# Altium schematic sheet ControllerV2.1_2.SchDoc
size A; SheetNumber: 2; SheetTotal: 2
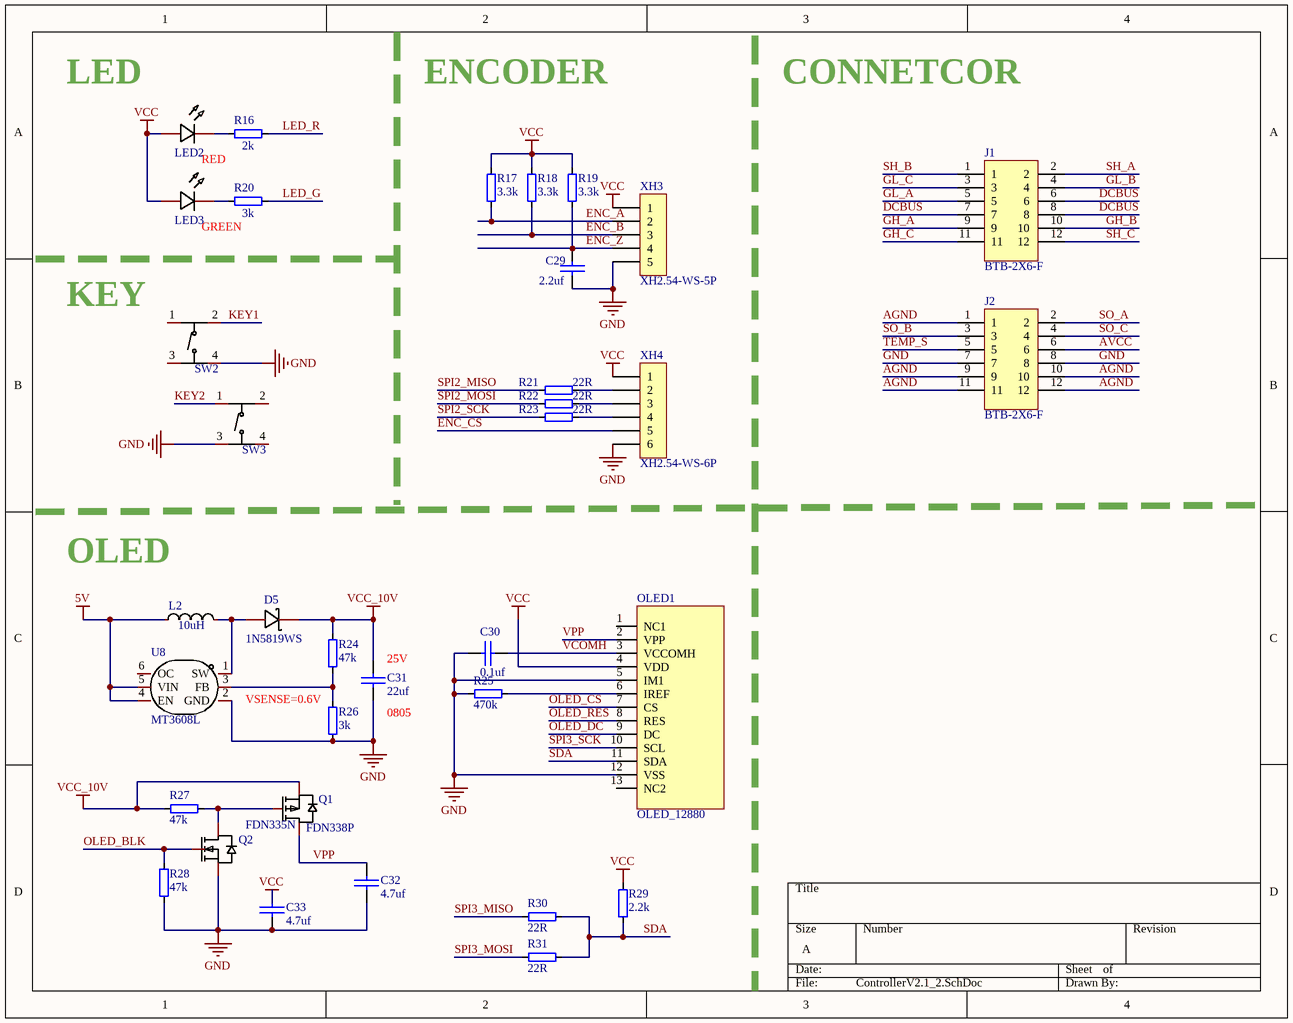
[diagram p0: ControllerV2.1_2.SchDoc]

## Parts
C29  2.2uf  [0603C]
C30  0.1uf  [0603C]
C31  22uf  [0805C]
C32  4.7uf  [0603C]
C33  4.7uf  [0603C]
D5  1N5819WS  [SOD-323]
J1  BTB-2X6-F  [BTB-F-0.8mm-2x6P]
J2  BTB-2X6-F  [BTB-F-0.8mm-2x6P]
L2  10uH  [IND-SMD_L3.0-W3.0_SWPA3010S]
LED2  LED_0603-B  [LED_0603]  (value not drawn)
LED3  LED_0603-B  [LED_0603]  (value not drawn)
OLED1  OLED_12880  [OLED_12880]
Q1  FDN338P  [SOT-23-3]
Q2  FDN335N  [SOT-23-3]
R16  2k  [0603R]
R17  3.3k  [0603R]
R18  3.3k  [0603R]
R19  3.3k  [0603R]
R20  3k  [0603R]
R21  22R  [0603R]
R22  22R  [0603R]
R23  22R  [0603R]
R24  47k  [0603R]
R25  470k  [0603R]
R26  3k  [0603R]
R27  47k  [0603R]
R28  47k  [0603R]
R29  2.2k  [0603R]
R30  22R  [0603R]
R31  22R  [0603R]
SW2  TS-1187A-B-A-B  [TSW SMD-4*4*1.5]  (value not drawn)
SW3  TS-1187A-B-A-B  [TSW SMD-4*4*1.5]  (value not drawn)
U8  MT3608L  [SOT-23-6]
XH3  XH2.54-WS-5P  [XH2.54-WS-5P]
XH4  XH2.54-WS-6P  [XH2.54-WS-6P]

## Nets
5V: L2.1 U8.4(EN) U8.5(VIN)
GND: C29.2 C30.1 C31.2 C32.2 C33.2 J2.7 J2.8 OLED1.5(IM1) OLED1.12(VSS) Q2.2(S) R25.1 R26.1 R28.1 SW2.4(D) SW3.3(C) U8.2(GND) XH3.5 XH4.6
VCC: C33.1 LED2.2(A) LED3.2(A) OLED1.4(VDD) R17.2 R18.2 R19.2 R29.2 XH3.1 XH4.1
VCC_10V: C31.1 D5.1(K) Q1.2(S) R24.2 R27.1
AGND: J2.1 J2.9 J2.10 J2.11 J2.12
AVCC: J2.6
DCBUS: J1.6 J1.7 J1.8
ENC_A: R17.1 XH3.2
ENC_B: R18.1 XH3.3
ENC_CS: XH4.5
ENC_Z: C29.1 R19.1 XH3.4
GH_A: J1.9
GH_B: J1.10
GH_C: J1.11
GL_A: J1.5
GL_B: J1.4
GL_C: J1.3
KEY1: SW2.2(B)
KEY2: SW3.1(A)
LED_G: R20.2
LED_R: R16.2
OLED_BLK: Q2.1(G) R28.2
OLED_CS: OLED1.7(CS)
OLED_DC: OLED1.9(DC)
OLED_RES: OLED1.8(RES)
SDA: OLED1.11(SDA) R29.1 R30.2 R31.2
SH_A: J1.2
SH_B: J1.1
SH_C: J1.12
SO_A: J2.2
SO_B: J2.3
SO_C: J2.4
SPI2_MISO: R21.1
SPI2_MOSI: R22.1
SPI2_SCK: R23.1
SPI3_MISO: R30.1
SPI3_MOSI: R31.1
SPI3_SCK: OLED1.10(SCL)
TEMP_S: J2.5
VCOMH: C30.2 OLED1.3(VCCOMH)
VPP: C32.1 OLED1.2(VPP) Q1.3(D)
NetD5_2: D5.2(A) L2.2 U8.1(SW)
NetLED2_1: LED2.1(C) R16.1
NetLED3_1: LED3.1(C) R20.1
NetOLED1_6: OLED1.6(IREF) R25.2
NetQ1_1: Q1.1(G) Q2.3(D) R27.2
NetR21_2: R21.2 XH4.2
NetR22_2: R22.2 XH4.3
NetR23_2: R23.2 XH4.4
NetR24_1: R24.1 R26.2 U8.3(FB)

Not connected (* = marked no-connect by the designer): OLED1 1(NC1) 13(NC2); SW2 1(A) 3(C); SW3 2(B) 4(D); U8 6(OC)

## Notes on the sheet
- LED
- ENCODER
- CONNETCOR
- RED
- GREEN
- KEY
- OLED
- VSENSE=0.6V
- (near C31) 25V
- (near C31) 0805

## Library data of the parts
C29-C33 = CAP: 贴片电容
D5 = 1N5819WS: 肖特基二极管; Manufacturer: Hottech(合科泰); Device: 1N5819WS_C191023; Add into BOM: yes; Forward Voltage (Vf@If): 600mV@1A; Reverse Voltage (Vr): 40V; Average Rectified Current (Io): 1A; Symbol: 1N5819WS; Supplier: LCSC; Supplier Part: C191023; Manufacturer Part: 1N5819WS; JLCPCB Part Class: 基础库; LCSC Part Name: 电压:40V 电流:1A; Supplier Footprint: SOD-323; Datasheet: https://atta.szlcsc.com/upload/public/pdf/source/20220428/3CB86FD8D28D653594B4E35F9D5AEFD9.pdf; Convert to PCB: yes
J1 J2 = BTB-2X6-F: 0.8间距2x6P母座
L2 = SWPA3015S100MT: 电感值:10uH;精度:±20%;额定电流:920mA;; Manufacturer: SXN(顺翔诺); Symbol: SMDRI74-220M; Add into BOM: yes; Value: 22uH; Tolerance: ±20%; Rated Current: 1.23A; DC Resistance (DCR): 110mΩ; Device: SMDRI74-220M; LCSC Part Name: 22uH ±20% 1.23A 110mΩ; Supplier Part: C164083; Manufacturer Part: SMDRI74-220M; Supplier Footprint: SMD; JLCPCB Part Class: Extended Part; Datasheet: https://atta.szlcsc.com/upload/public/pdf/source/20210810/6F96FDC19AA308DD2AD166FFB9640E87.pdf; Supplier: LCSC; Convert to PCB: yes
LED2 LED3 = LED: Symbol: LED_B; Convert to PCB: yes; Device: LED_0603-B; Add into BOM: yes; Supplier Footprint: 0603
OLED1 = OLED_12880: OLED_128*80
Q1 = FDN338P: P沟道 耐压:20V 电流:2A; Manufacturer: TECH PUBLIC(台舟); Symbol: FDN338P_C2890130; Add into BOM: yes; Device: FDN338P; LCSC Part Name: FDN338P; Supplier Part: C2890130; Manufacturer Part: FDN338P; Supplier Footprint: SOT-23; JLCPCB Part Class: 扩展库; Datasheet: https://atta.szlcsc.com/upload/public/pdf/source/20210903/7E6CB84F0F80073F6978D1021964D836.pdf; Supplier: LCSC; Convert to PCB: yes
Q2 = FDN335N: N沟道 耐压:20V 电流:1.7A; Manufacturer: TECH PUBLIC(台舟); Symbol: FDN335N_C5123904; Add into BOM: yes; Device: FDN335N_C5123904; Supplier: LCSC; Supplier Part: C5123904; Manufacturer Part: FDN335N; JLCPCB Part Class: 扩展库; LCSC Part Name: FDN335N; Supplier Footprint: SOT-23(TO-236); Datasheet: https://atta.szlcsc.com/upload/public/pdf/source/20221011/C6D62871DD587F26C6CC0F7FCE0BC659.pdf; Convert to PCB: yes
R16-R31 = RES: 贴片电阻
SW2 SW3 = TS-1187A-B-A-B: 轻触开关; Manufacturer: XKB Connectivity(中国星坤); Add into BOM: yes; Circuit: 单刀单掷; Actuator Style: 圆形按钮; Switch Length: 5.1mm; Switch Height: 1.5mm; Strike Gundam: 不带; Contact Current: 50mA; Voltage Rating (DC): 12V; Actuator/Cap Color: 金色; With Lamp: 无; Operating Force: 160gf; Mechanical Life: 10万次; Symbol: TS-1187A-B-A-B; Device: TS-1187A-B-A-B; Supplier: LCSC; Supplier Part: C318884; Manufacturer Part: TS-1187A-B-A-B; JLCPCB Part Class: 基础库; LCSC Part Name: 5.1*5.1*1.5mm 立贴 轻触开关; Supplier Footprint: SMD; Datasheet: https://atta.szlcsc.com/upload/public/pdf/source/20200227/C318890_053E50208A88A7BA1965D8746000774E.pdf; Convert to PCB: yes; Switch Width: 5.1mm; Mounting Style: 立贴; Insulation Resistance: -; Operating Temperature: -30℃~+85℃
U8 = MT3608L: Manufacturer: 西安航天民芯; Add into BOM: yes; Symbol: MT3608L; Device: MT3608L; LCSC Part Name: MT3608L; Supplier Part: C2932326; Manufacturer Part: MT3608L; Supplier Footprint: SOT-23-6; JLCPCB Part Class: 扩展库; Datasheet: https://atta.szlcsc.com/upload/public/pdf/source/20211213/953A62CC1033762E00AABAD4906DD7F1.pdf; Supplier: LCSC; Convert to PCB: yes